# Altium schematic sheet ALLPRINT-CAPBOARD-677512-HEAD-BOARD-COMM.SchDoc
size A3; Organization: Altium Limited; Address1: 3 Minna Close; Address2: Belrose; Address3: NSW 2085; Address4: Australia; DocumentNumber: 6; SheetNumber: 5; SheetTotal: 11
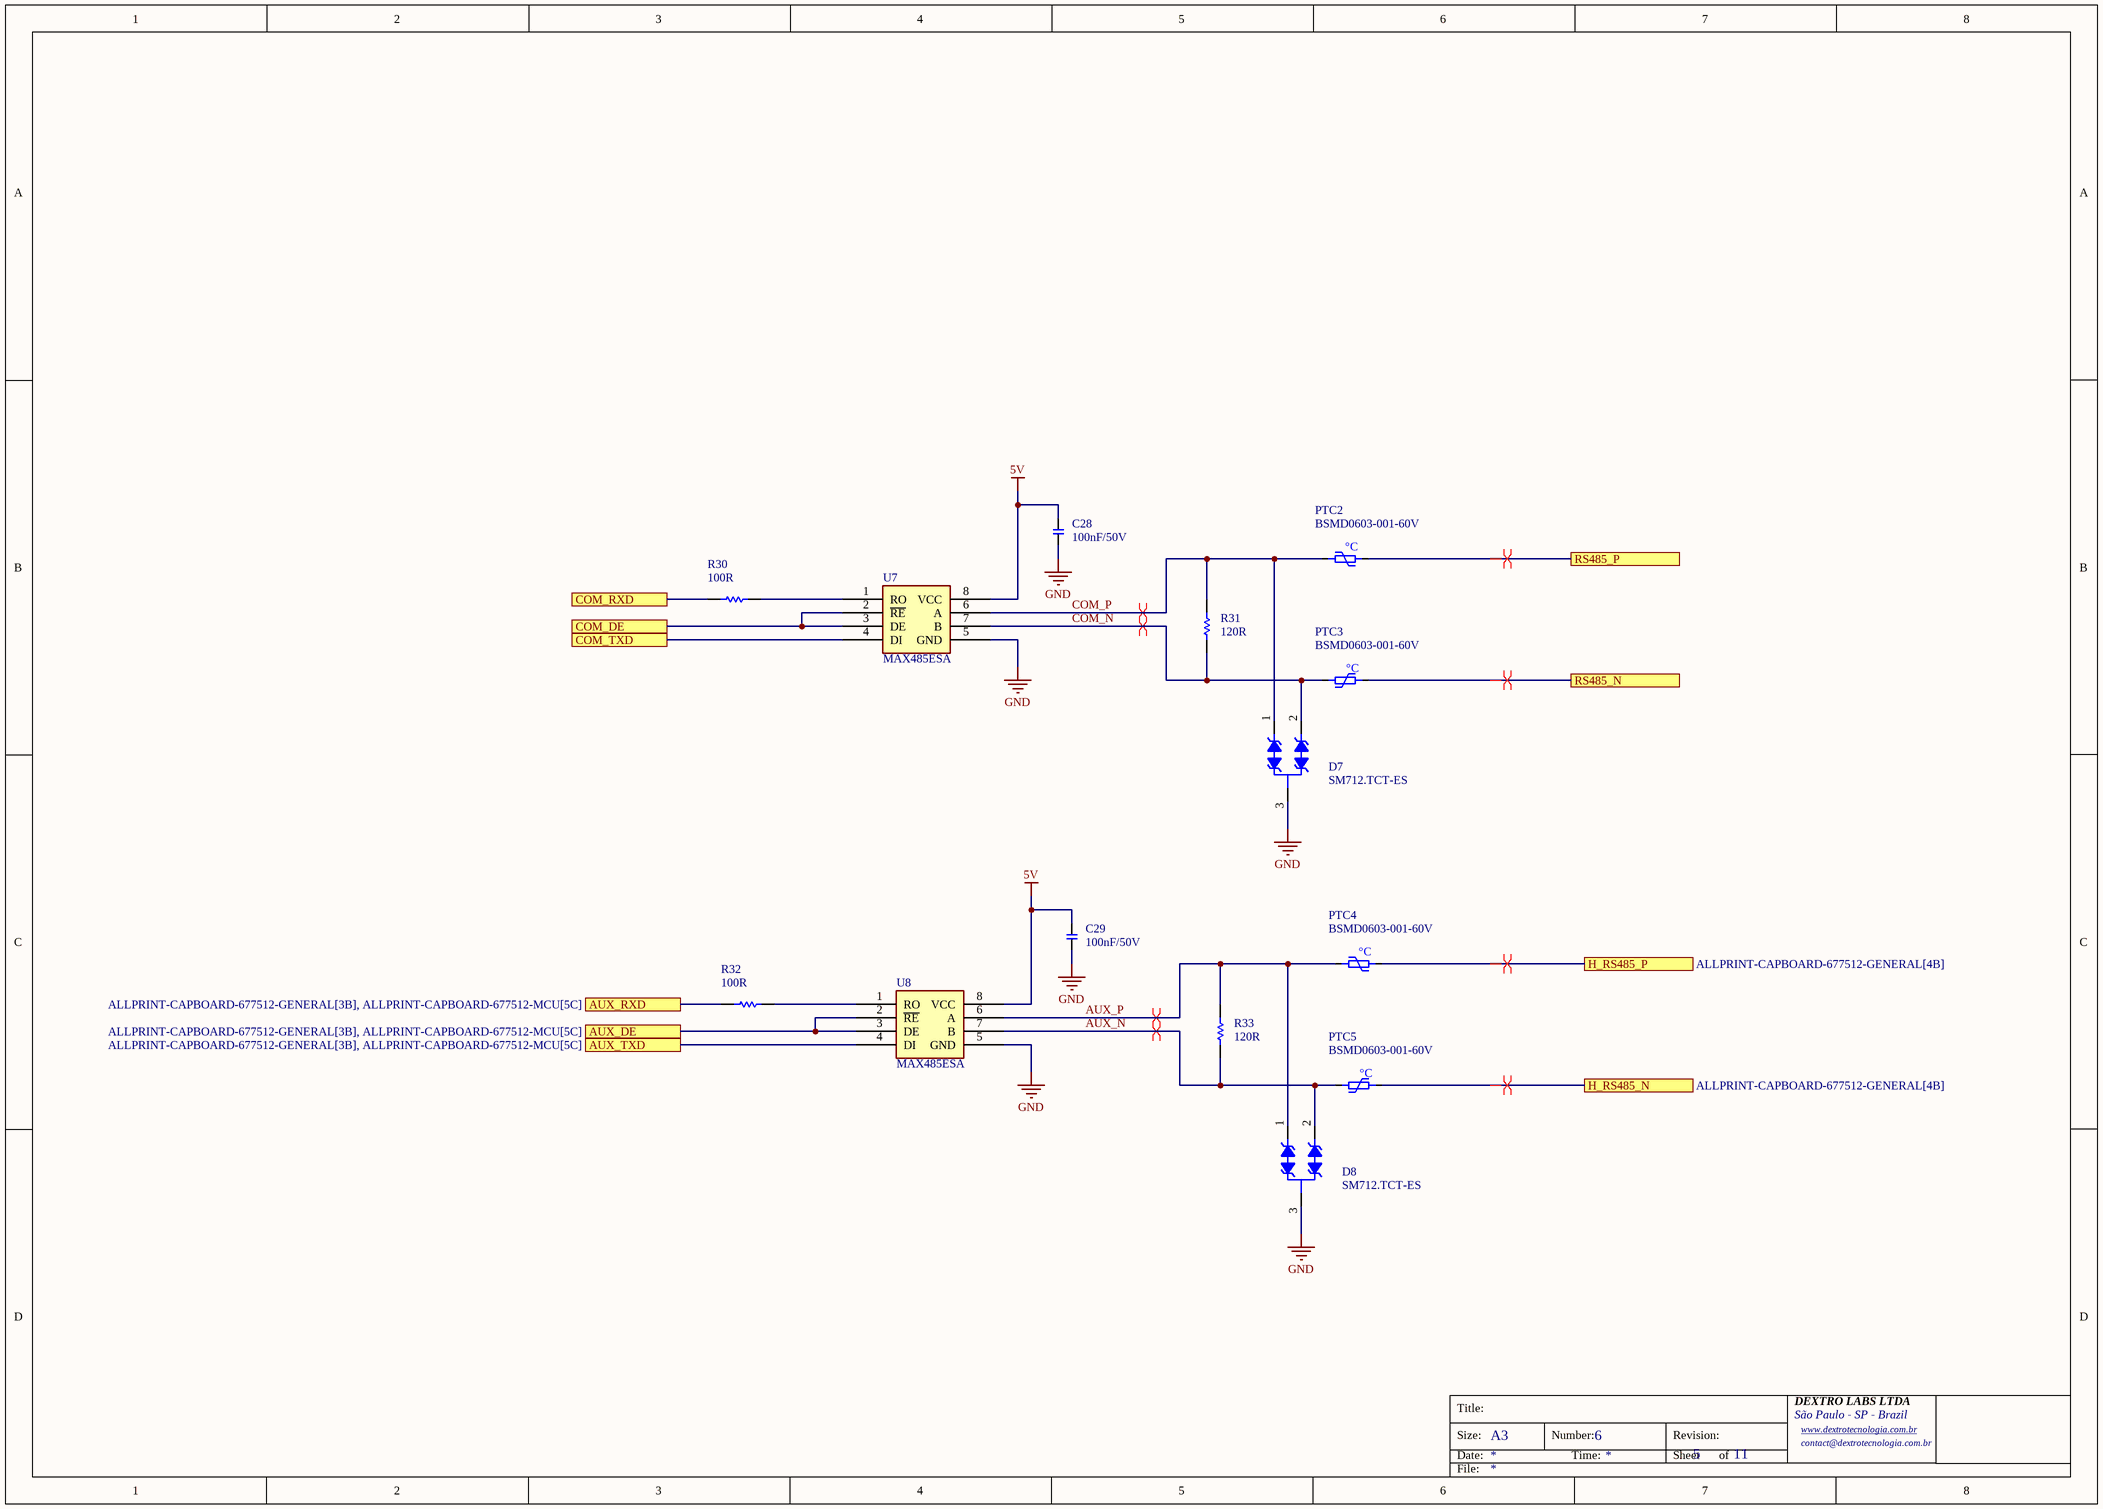
[diagram p0: ALLPRINT-CAPBOARD-677512-HEAD-BOARD-COMM.SchDoc]

## Parts
C28  100nF/50V  [CAP-0603]
C29  100nF/50V  [CAP-0603]
D7  SM712.TCT-ES  [SOT23-3]
D8  SM712.TCT-ES  [SOT23-3]
PTC2  BSMD0603-001-60V  [PTC-0603]
PTC3  BSMD0603-001-60V  [PTC-0603]
PTC4  BSMD0603-001-60V  [PTC-0603]
PTC5  BSMD0603-001-60V  [PTC-0603]
R30  100R  [RES-0603]
R31  120R  [RES-1206]
R32  100R  [RES-0603]
R33  120R  [RES-1206]
U7  MAX485ESA  [SOIC-08]
U8  MAX485ESA  [SOIC-08]

## Ports
AUX_DE (see ALLPRINT-CAPBOARD-677512-GENERAL[3B], ALLPRINT-CAPBOARD-677512-MCU[5C]), AUX_RXD (see ALLPRINT-CAPBOARD-677512-GENERAL[3B], ALLPRINT-CAPBOARD-677512-MCU[5C]), AUX_TXD (see ALLPRINT-CAPBOARD-677512-GENERAL[3B], ALLPRINT-CAPBOARD-677512-MCU[5C]), COM_DE (see ALLPRINT-CAPBOARD-677512-GENERAL[3B], ALLPRINT-CAPBOARD-677512-MCU[5A]), COM_RXD (see ALLPRINT-CAPBOARD-677512-GENERAL[3B], ALLPRINT-CAPBOARD-677512-MCU[5A]), COM_TXD (see ALLPRINT-CAPBOARD-677512-GENERAL[3B], ALLPRINT-CAPBOARD-677512-MCU[5A]), H_RS485_N (see ALLPRINT-CAPBOARD-677512-GENERAL[4B]), H_RS485_P (see ALLPRINT-CAPBOARD-677512-GENERAL[4B]), RS485_N (see ALLPRINT-CAPBOARD-677512-GENERAL[4B]), RS485_P (see ALLPRINT-CAPBOARD-677512-GENERAL[4B])

## Nets
5V: C28.2 C29.2 U7.8(VCC) U8.8(VCC)
GND: C28.1 C29.1 D7.3(K) D8.3(K) U7.5(GND) U8.5(GND)
AUX_DE: U8.2(~{RE}) U8.3(DE) ; port AUX_DE
AUX_N: D8.2(A2) PTC5.2 R33.1 U8.7(B)
AUX_P: D8.1(A1) PTC4.1 R33.2 U8.6(A)
AUX_RXD: R32.1 ; port AUX_RXD
AUX_TXD: U8.4(DI) ; port AUX_TXD
COM_DE: U7.2(~{RE}) U7.3(DE) ; port COM_DE
COM_N: D7.2(A2) PTC3.2 R31.1 U7.7(B)
COM_P: D7.1(A1) PTC2.1 R31.2 U7.6(A)
COM_RXD: R30.1 ; port COM_RXD
COM_TXD: U7.4(DI) ; port COM_TXD
H_RS485_N: PTC5.1 ; port H_RS485_N
H_RS485_P: PTC4.2 ; port H_RS485_P
RS485_N: PTC3.1 ; port RS485_N
RS485_P: PTC2.2 ; port RS485_P
NetR30_2: R30.2 U7.1(RO)
NetR32_2: R32.2 U8.1(RO)

## Layout directives
differential pair; net class DIFF120; differential pair class DIFF120: AUX_N, AUX_P, COM_N, COM_P, H_RS485_N, H_RS485_P, RS485_N, RS485_P

## Notes on the sheet
- Title:
- Size:
- Date:
- A3
- Number:
- Time:
- Revision:
- Sheet
- of
- DEXTRO LABS LTDA
- São Paulo - SP - Brazil
- www.dextrotecnologia.com.br <http://www.dextrotecnologia.com.br>
- contact@dextrotecnologia.com.br
- File:
- (in symbol PTC-FUSE-60V-10mA-0603) °C

## Library data of the parts
C28 C29 = CAP-100nF/50V-0603-X7R-MLCC: 50V 100nF X7R ±10% 0603 Multilayer Ceramic Capacitors MLCC - SMD/SMT ROHS; LCSC: C14663
D7 D8 = SM712.TCT-ES: 400W@8/20us Bidirectional SOT-23 ESD and Surge Protection (TVS/ESD) ROHS; LCSC: C22363671
PTC2-PTC5 = PTC-FUSE-60V-10mA-0603: 60V 10mA 20A 50mA 15Ω 0603 PTC Resettable Fuses ROHS; LCSC: C914088
R30 R32 = RES-100R-1%-100mW-0603: 100mW Thick Film Resistor 75V ±100ppm/℃ ±1% 100Ω 0603 Chip Resistor - Surface Mount ROHS; LCSC: C105588
R31 R33 = RES-120R-1%-500mW-1206: 120Ω ±1% 500mW 1206 Thick Film Resistor; LCSC: C5713417
U7 U8 = MAX485ESA: Low-Power, Slew-Rate-Limited RS-485/RS-422 Transceivers; LCSC: C5279041